# EAGLE schematic esp-rs485 (EAGLE 9.6.2)
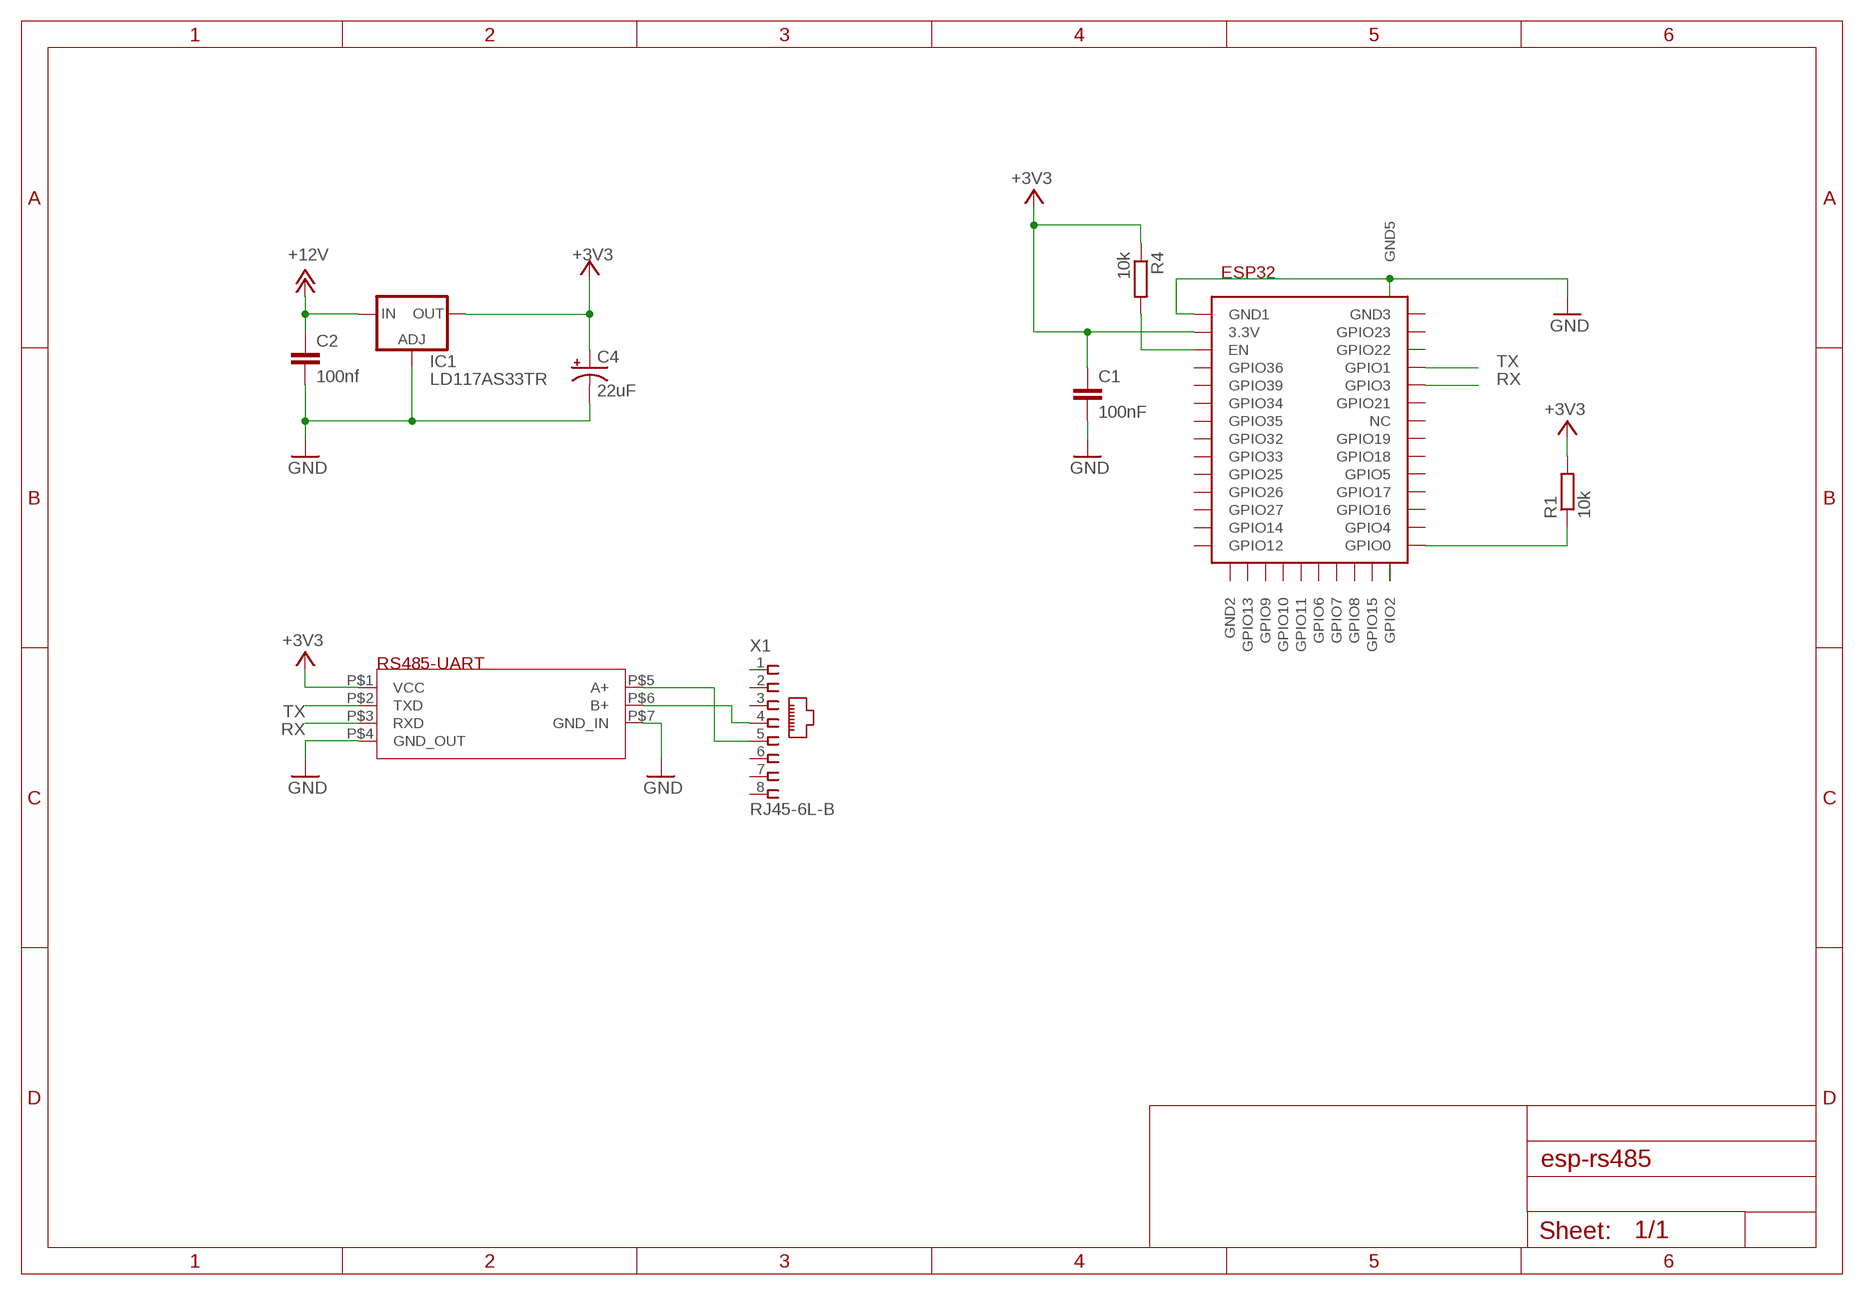
[diagram p0: schematic, sheet 1]

## Parts
C1  100nF  C-EUC0805K  [C0805K]
C2  100nf  C-EUC0805K  [C0805K]
C4  22uF  CPOL-USE2.5-5  [E2,5-5]
IC1  LD117AS33TR  [SOT223]
R1  10k  R-EU_M0805  [M0805]
R4  10k  R-EU_M0805  [M0805]
U$2  ESP32-WROOM  [ESP32-WROOM]
U$3  RS485-ADAPTER  [RS485-ADAPTER]
X1  RJ45-6L-B  [RJ45-NO-SHIELD]

## Nets
+3V3 [230vac]: C1.1 C4.+ IC1.4(OUT) R1.2 R4.1 U$2.3V3(3.3V) U$3.P$1(VCC)
+12V: C2.1 IC1.3(IN)
GND [230vac]: C1.2 C2.2 C4.- IC1.1(ADJ) U$2.GND1 U$2.GND5 U$3.P$4(GND_OUT) U$3.P$7(GND_IN)
N$1: R4.2 U$2.EN
N$2: R1.1 U$2.IO0(GPIO0)
N$3: U$3.P$5(A+) X1.5
N$4: U$3.P$6(B+) X1.4
N$5 [230vac]: U$2.IO2(GPIO2)
RX: U$2.RX(GPIO3) U$3.P$3(RXD)
TX: U$2.TX(GPIO1) U$3.P$2(TXD)
Unconnected: U$2.CLK(GPIO6) U$2.CMD(GPIO11) U$2.GND2(GND3) U$2.GND3(NC) U$2.GND4(GND2) U$2.IO4(GPIO4) U$2.IO5(GPIO5) U$2.IO12(GPIO12) U$2.IO13(GPIO13) U$2.IO14(GPIO14) U$2.IO15(GPIO15) U$2.IO16(GPIO16) U$2.IO17(GPIO17) U$2.IO18(GPIO18) U$2.IO19(GPIO19) U$2.IO21(GPIO21) U$2.IO22(GPIO22) U$2.IO23(GPIO23) U$2.IO25(GPIO25) U$2.IO26(GPIO26) U$2.IO27(GPIO27) U$2.IO32(GPIO32) U$2.IO33(GPIO33) U$2.IO34(GPIO34) U$2.IO35(GPIO35) U$2.SD0(GPIO7) U$2.SD1(GPIO8) U$2.SD2(GPIO9) U$2.SD3(GPIO10) U$2.SENSOR_VN(GPIO39) U$2.SENSOR_VP(GPIO36) X1.1 X1.2 X1.3 X1.6 X1.7 X1.8

## Library data of the parts
C1 C2 = rcl:C-EU: CAPACITOR, European symbol
C4 = rcl:CPOL-US: POLARIZED CAPACITOR, American symbol
IC1 = v-reg:LD117A?*: Low drop fixed and adjustable positive voltage regulators 1 A Source: http://www.st.com/stonline/products/literature/ds/7194/ld1117axx.pdf
R1 R4 = rcl:R-EU_: RESISTOR, European symbol
U$2 = ESP32_try:ESP32-WROOM
U$3 = ESP32_try:RS485-ADAPTER
X1 = con-tycoelectronics:RJ45: CORCOM Modular RJ Jacks No Shield Source: www.tycoelectronics.com .. ENG_DS_1654001_1099_RJ_L_0507.pdf; MPN: RJ45-6L-B; OC_FARNELL: unknown; OC_NEWARK: 16R6090

## Net classes
1 230vac: width 0.762 mm
2 5vdc: width 0.508 mm